# Altium schematic sheet GateDriver.SchDoc
size A
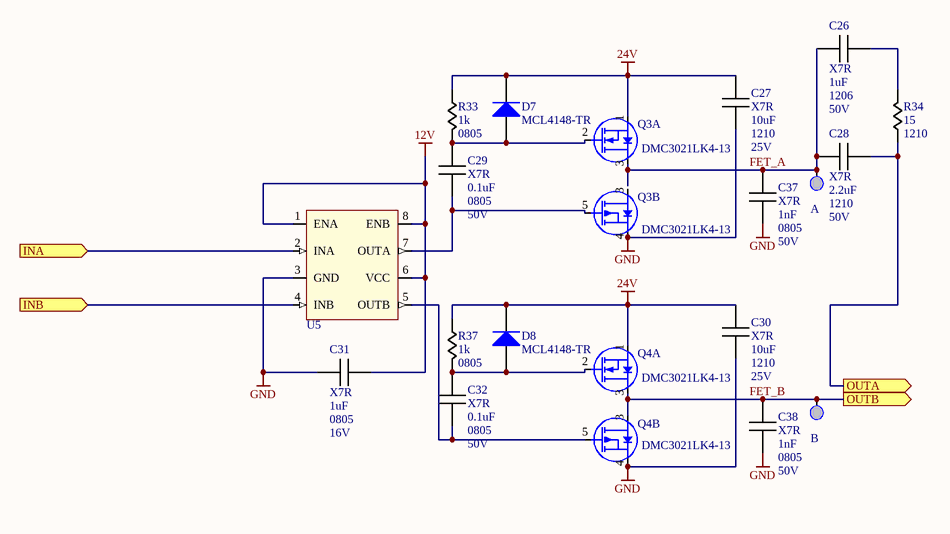
[diagram p0: GateDriver.SchDoc]

## Parts
A  Testpoint  [Keystone5002]  (value not drawn)
B  Testpoint  [Keystone5002]  (value not drawn)
C26  Material: X7R  Capacitance: 1uF  Package: 1206  Voltage: 50V  [1206C]  (hidden comment: GRM31MR71H105KA88L)
C27  Material: X7R  Capacitance: 10uF  Package: 1210  Voltage: 25V  [1210C]  (hidden comment: 885012209028)
C28  Material: X7R  Capacitance: 2.2uF  Package: 1210  Voltage: 50V  [1210C]  (hidden comment: CGA6M3X7R1H225K200AB)
C29  Material: X7R  Capacitance: 0.1uF  Package: 0805  Voltage: 50V  [0805C]  (hidden comment: 08055C104JAT2A)
C30  Material: X7R  Capacitance: 10uF  Package: 1210  Voltage: 25V  [1210C]  (hidden comment: 885012209028)
C31  Material: X7R  Capacitance: 1uF  Package: 0805  Voltage: 16V  [0805C]  (hidden comment: CC0805KKX7R7BB105)
C32  Material: X7R  Capacitance: 0.1uF  Package: 0805  Voltage: 50V  [0805C]  (hidden comment: 08055C104JAT2A)
C37  Material: X7R  Capacitance: 1nF  Package: 0805  Voltage: 50V  [0805C]  (hidden comment: C0805C102K5RACTU)
C38  Material: X7R  Capacitance: 1nF  Package: 0805  Voltage: 50V  [0805C]  (hidden comment: C0805C102K5RACTU)
D7  MCL4148-TR  [MicroMELF]
D8  MCL4148-TR  [MicroMELF]
Q3  DMC3021LK4-13  [TO-252]  (parts A,B of 2)
Q4  DMC3021LK4-13  [TO-252]  (parts A,B of 2)
R33  Resistance: 1k  Package: 0805  [0805R]  (hidden comment: RC0805FR-071KL)
R34  Resistance: 15  Package: 1210  [1210R]  (hidden comment: CRCW121015R0JNEAHP)
R37  Resistance: 1k  Package: 0805  [0805R]  (hidden comment: RC0805FR-071KL)
U5  MIC4126YME  [SOIC-8]  (value not drawn)

## Ports
INA (in), INB (in), OUTA (out), OUTB (out)

## Nets
12V: C31.2 U5.1(ENA) U5.6(VCC) U5.8(ENB)
24V: C27.1 C30.1 D7.K D8.K Q3.1(S1) Q4.1(S1) R33.2 R37.2
GND: C27.2 C30.2 C31.1 C37.1 C38.1 Q3.4(S2) Q4.4(S2) U5.3(GND)
FET_A: A.1 C26.1 C28.1 C37.2 Q3.3(D1/D2)
FET_B: B.1 C38.2 Q4.3(D1/D2) ; port OUTB
INA: U5.2(INA) ; port INA
INB: U5.4(INB) ; port INB
OUTA: C28.2 R34.2 ; port OUTA
NetC26_2: C26.2 R34.1
NetC29_1: C29.1 Q3.5(G2) U5.7(OUTA)
NetC29_2: C29.2 D7.A Q3.2(G1) R33.1
NetC32_1: C32.1 Q4.5(G2) U5.5(OUTB)
NetC32_2: C32.2 D8.A Q4.2(G1) R37.1

## Library data of the parts
C26 = Capacitor: CAP CER 1UF 50V X7R 1206; Tolerance: 10%; Mouser Part: 81-GRM31MR71H105KA88; Digikey Part: 490-6527-1-ND
C27 C30 = Capacitor: CAP CER 10UF 25V X7R 1210; Tolerance: *; Mouser Part: 710-885012207094; Digikey Part: 732-7729-1-ND
C28 = Capacitor: CAP ALUM 100UF 20% 16V RADIAL; Tolerance: 10%; Mouser Part: 810-CGA6M3X7R1H225K; Digikey Part: 445-5715-1-ND
C29 C32 = Capacitor: CAP CER 0.1UF 50V X7R 0805; Tolerance: *; Mouser Part: 581-08055C104J; Digikey Part: 478-3352-1-ND
C31 = Capacitor: CAP CER 1UF 16V X7R 0805; Tolerance: 10%; Mouser Part: 603-CC805KKX7R7BB105; Digikey Part: 311-1365-1-ND
C37 C38 = Capacitor: CAP CER 1000PF 50V X7R 0805; Tolerance: *; Mouser Part: 80-C0805C102K5R; Digikey Part: 399-1147-1-ND
D7 D8 = 1N4148: DIODE GEN 75V 150MA MICROMELF; Mouser Part: 78-MCL4148; Digikey Part: MCL4148CT-ND
Q3 Q4 = FDD8424H: MOSFET N/P-CH 30V TO252-4L; Mouser Part: 621-DMC3021LK4-13; Digikey Part: DMC3021LK4-13DICT-ND
R33 R37 = Resistor: RES SMD 1K OHM 1% 1/8W 0805; Power: 0.125W; Tolerance: 1%; Mouser Part: 603-RC0805FR-071KL; Digikey Part: 311-1.00KCRCT-ND
R34 = Resistor: RES SMD 15 OHM 5% 3/4W 1210; Power: 750mW; Tolerance: 5%; Mouser Part: 71-CRCW121015R0JNEAH; Digikey Part: 541-15NCT-ND
U5 = UCC27423D: IC DRIVER MOSFET 1.5A DUAL 8SOIC; Mouser Part: 998-MIC4126YME; Digikey Part: 576-1185-ND
A B = Testpoint: Digikey Part: 36-5002-ND; Mouser Part: 534-5002